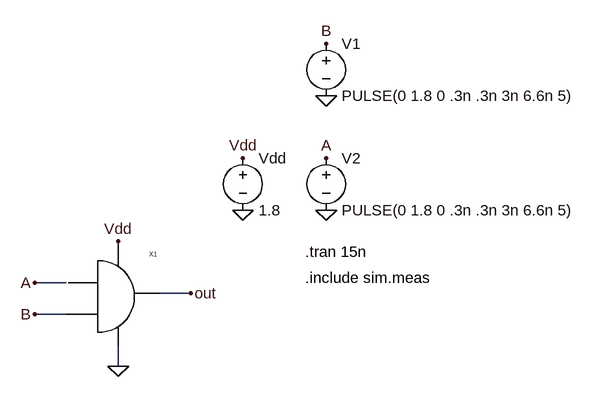
[diagram p0: schematic device_testing.asc]
device_testing.asc, the LTspice schematic file:
Version 4.1
SHEET 1 1048 896
WIRE 128 80 80 80
WIRE 320 96 272 96
WIRE 128 128 80 128
WIRE 208 208 208 176
FLAG 400 -32 0
FLAG 208 208 0
FLAG 528 -32 0
FLAG 80 80 A
FLAG 320 96 out
FLAG 400 -112 Vdd
FLAG 208 16 Vdd
FLAG 528 -112 A
FLAG 80 128 B
FLAG 528 -208 0
FLAG 528 -288 B
SYMBOL voltage 400 -128 R0
SYMATTR InstName Vdd
SYMATTR Value 1.8
SYMBOL voltage 528 -128 R0
SYMATTR InstName V2
SYMATTR Value PULSE(0 1.8 0 .3n .3n 3n 6.6n 5)
SYMBOL CMOS_AND 96 112 R0
SYMATTR InstName X1
SYMBOL voltage 528 -304 R0
SYMATTR InstName V1
SYMATTR Value PULSE(0 1.8 0 .3n .3n 3n 6.6n 5)
TEXT 496 72 Left 2 !.include sim.meas
TEXT 496 32 Left 2 !.tran 15n

The netlist it stands for:
* device_testing.asc
Vdd Vdd 0 1.8
V2 A 0 PULSE(0 1.8 0 .3n .3n 3n 6.6n 5)
X§X1 Vdd A B out 0 CMOS_AND  ; pins Vdd A B out ground
V1 B 0 PULSE(0 1.8 0 .3n .3n 3n 6.6n 5)
.include sim.meas
.tran 15n
.backanno
.end

* Results of the author's LTspice run, read from the files saved beside the schematic
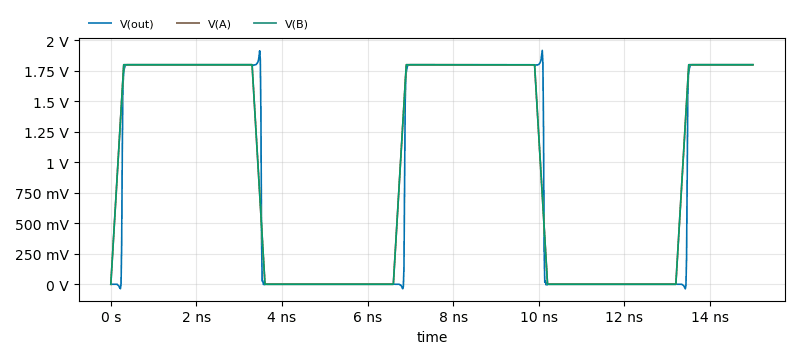
[diagram p1: Transient Analysis of device_testing.asc, plotted from the saved traces]
* Transient Analysis, 1 run:
*   V(out): min -37.22 mV, max 1.918 V, average 963.8 mV, rms 1.315 V, last 1.8 V
*   V(A): min 0 V, max 1.8 V, average 990 mV, rms 1.315 V, last 1.8 V
*   V(B): min 0 V, max 1.8 V, average 990 mV, rms 1.315 V, last 1.8 V